# Altium schematic sheet touch.SchDoc
size A4
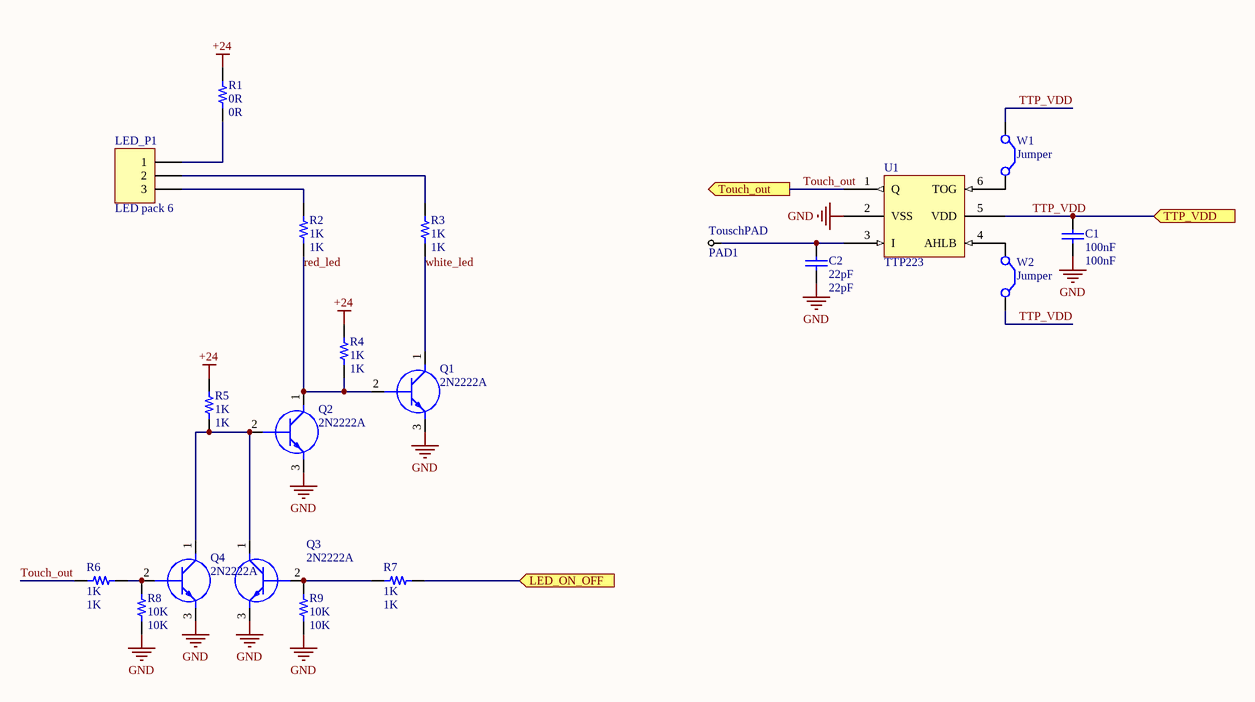
[diagram p0: touch.SchDoc]

## Parts
C1  100nF  [0603C]
C2  22pF  [0603C]
LED_P1  LED pack 6  [ledpack6-b]
PAD1  TouschPAD  [touchPAD2]  (no BOM)
Q1  2N2222A  [soT95p280x130-3n]
Q2  2N2222A  [soT95p280x130-3n]
Q3  2N2222A  [soT95p280x130-3n]
Q4  2N2222A  [soT95p280x130-3n]
R1  0R  [0603R]
R2  1K  [RES1812]
R3  1K  [RES1812]
R4  1K  [0603R]
R5  1K  [0603R]
R6  1K  [0603R]
R7  1K  [0603R]
R8  10K  [0603R]
R9  10K  [0603R]
U1  TTP223  [SOT23-6_L]
W1  Jumper  [JUMPER]  (no BOM)
W2  Jumper  [JUMPER]  (no BOM)

## Ports
LED_ON_OFF (in), Touch_out (out), TTP_VDD (in)

## Nets
+24: R1.2 R4.1 R5.1
GND: C1.1 C2.1 Q1.3(E) Q2.3(E) Q3.3(E) Q4.3(E) R8.2 R9.2 U1.2(VSS)
LED_ON_OFF: R7.2 ; port LED_ON_OFF
red_led: Q1.2(B) Q2.1(C) R2.2 R4.2
Touch_out: R6.1 U1.1(Q) ; port Touch_out
TTP_VDD: C1.2 U1.5(VDD) W1.1(C1) W2.2(C2) ; port TTP_VDD
white_led: Q1.1(C) R3.2
NetC2_2: C2.2 PAD1.1(T) U1.3(I)
NetLED_P1_1: LED_P1.1 R1.1
NetLED_P1_2: LED_P1.2 R3.1
NetLED_P1_3: LED_P1.3 R2.1
NetQ2_2: Q2.2(B) Q3.1(C) Q4.1(C) R5.2
NetQ3_2: Q3.2(B) R7.1 R9.1
NetQ4_2: Q4.2(B) R6.2 R8.1
NetU1_4: U1.4(AHLB) W2.1(C1)
NetU1_6: U1.6(TOG) W1.2(C2)

## Library data of the parts
C1 = Cap: CAP SMD 0603; Published: 8-Jun-2000; LatestRevisionDate: 17-Jul-2002; LatestRevisionNote: Re-released for DXP Platform.; PackageReference: RAD-0.3; Publisher: Altium Limited; PackageDescription: Radial Cap, Thru-Hole; 2 Leads; 0.3 in Pin Spacing; Value: 100nF
C2 = Cap: X7R_NPO; Published: 8-Jun-2000; LatestRevisionDate: 17-Jul-2002; LatestRevisionNote: Re-released for DXP Platform.; PackageReference: RAD-0.3; Publisher: Altium Limited; PackageDescription: Radial Cap, Thru-Hole; 2 Leads; 0.3 in Pin Spacing; Value: 22pF
LED_P1 = Header 3: 6led-red white LED pack; LatestRevisionDate: 17-Jul-2002; LatestRevisionNote: Re-released for DXP Platform.; Publisher: Altium Limited
PAD1 = Test Point
Q1-Q4 = 2N2222A: Transistor BJT NPN SMD; pin to pad: 1>3 2>1 3>2; Manufacturer_Name: Foshan Blue Rocket Elec; Datasheet Link: https://datasheet.lcsc.com/szlcsc/1901291437_Foshan-Blue-Rocket-Elec-2N2222A_C358533.pdf; Height: 4.7mm; Manufacturer_Part_Number: 2N2222A
R1 R4-R9 = Resistor: RES SMD 0603; Part Number: RCS0805100KFKEA
  R1: Value: 0R
  R4-R7: Value: 1K
  R8 R9: Value: 10K
R2 R3 = Resistor: RES SMD 1812; Part Number: RCS0805100KFKEA; Value: 1K
U1 = ttp223b: capacitive touch IC
W1 W2 = Jumper: Jumper Wire; Published: 24-Mar-1999; LatestRevisionDate: 17-Jul-2002; LatestRevisionNote: Re-released for DXP Platform.; PackageReference: RAD-0.2; Publisher: Altium Limited; PackageDescription: Radial Cap, Thru-Hole; 2 Leads; 0.2 in Pin Spacing